# EAGLE schematic ttl (EAGLE 5.01)
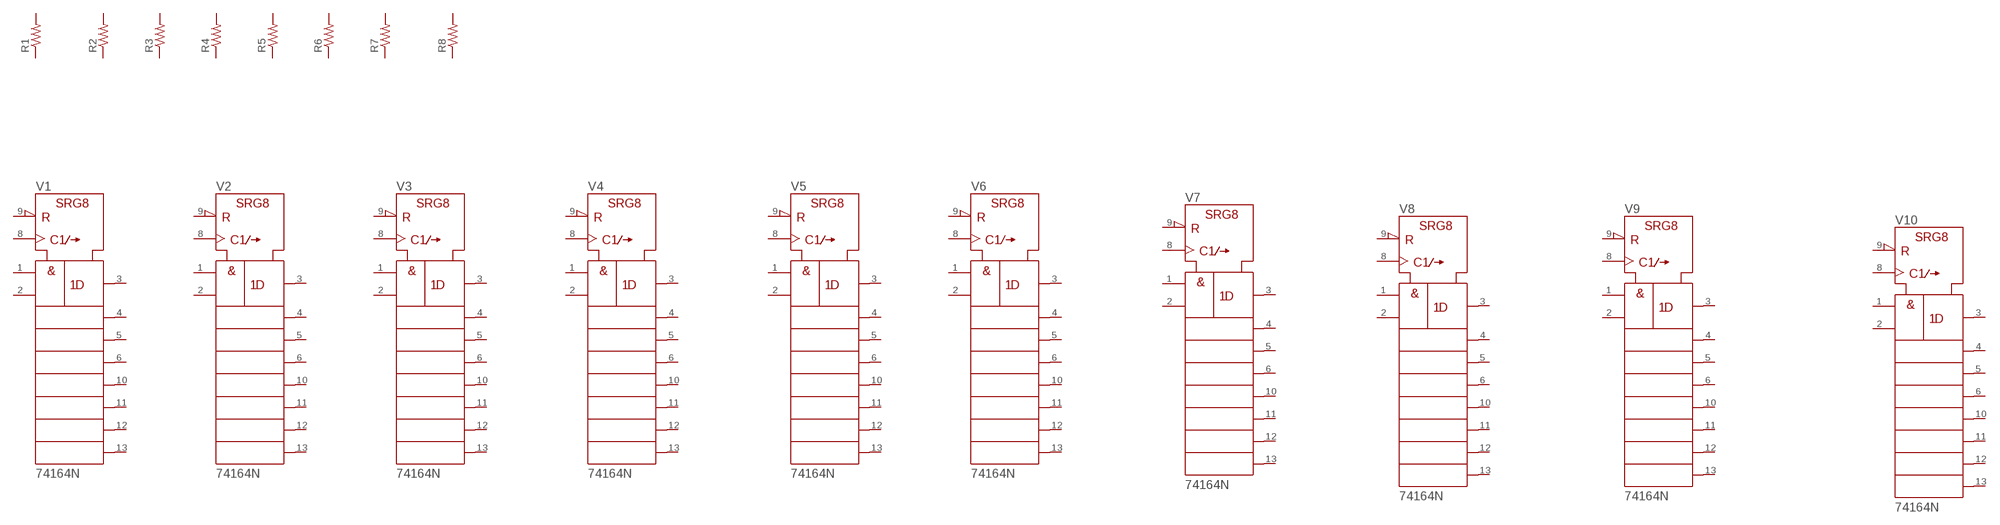
[diagram p0: schematic, sheet 1]

## Parts
R1  R-US_0204/5  [0204/5]
R2  R-US_0204/5  [0204/5]
R3  R-US_0204/5  [0204/5]
R4  R-US_0204/5  [0204/5]
R5  R-US_0204/5  [0204/5]
R6  R-US_0204/5  [0204/5]
R7  R-US_0204/5  [0204/5]
R8  R-US_0204/5  [0204/5]
V1  74164N  [DIL14]
V2  74164N  [DIL14]
V3  74164N  [DIL14]
V4  74164N  [DIL14]
V5  74164N  [DIL14]
V6  74164N  [DIL14]
V7  74164N  [DIL14]
V8  74164N  [DIL14]
V9  74164N  [DIL14]
V10  74164N  [DIL14]
Unconnected: R1.1 R1.2 R2.1 R2.2 R3.1 R3.2 R4.1 R4.2 R5.1 R5.2 R6.1 R6.2 R7.1 R7.2 R8.1 R8.2 V1.1(A) V1.2(B) V1.3(QA) V1.4(QB) V1.5(QC) V1.6(QD) V1.8(CLK) V1.9(!CLR) V1.10(QE) V1.11(QF) V1.12(QG) V1.13(QH) V2.1(A) V2.2(B) V2.3(QA) V2.4(QB) V2.5(QC) V2.6(QD) V2.8(CLK) V2.9(!CLR) V2.10(QE) V2.11(QF) V2.12(QG) V2.13(QH) V3.1(A) V3.2(B) V3.3(QA) V3.4(QB) V3.5(QC) V3.6(QD) V3.8(CLK) V3.9(!CLR) V3.10(QE) V3.11(QF) V3.12(QG) V3.13(QH) V4.1(A) V4.2(B) V4.3(QA) V4.4(QB) V4.5(QC) V4.6(QD) V4.8(CLK) V4.9(!CLR) V4.10(QE) V4.11(QF) V4.12(QG) V4.13(QH) V5.1(A) V5.2(B) V5.3(QA) V5.4(QB) V5.5(QC) V5.6(QD) V5.8(CLK) V5.9(!CLR) V5.10(QE) V5.11(QF) V5.12(QG) V5.13(QH) V6.1(A) V6.2(B) V6.3(QA) V6.4(QB) V6.5(QC) V6.6(QD) V6.8(CLK) V6.9(!CLR) V6.10(QE) V6.11(QF) V6.12(QG) V6.13(QH) V7.1(A) V7.2(B) V7.3(QA) V7.4(QB) V7.5(QC) V7.6(QD) V7.8(CLK) V7.9(!CLR) V7.10(QE) V7.11(QF) V7.12(QG) V7.13(QH) V8.1(A) V8.2(B) V8.3(QA) V8.4(QB) V8.5(QC) V8.6(QD) V8.8(CLK) V8.9(!CLR) V8.10(QE) V8.11(QF) V8.12(QG) V8.13(QH) V9.1(A) V9.2(B) V9.3(QA) V9.4(QB) V9.5(QC) V9.6(QD) V9.8(CLK) V9.9(!CLR) V9.10(QE) V9.11(QF) V9.12(QG) V9.13(QH) V10.1(A) V10.2(B) V10.3(QA) V10.4(QB) V10.5(QC) V10.6(QD) V10.8(CLK) V10.9(!CLR) V10.10(QE) V10.11(QF) V10.12(QG) V10.13(QH)

## Power pins joined to a net without a drawn wire
+UB: V1.14(+UB) V2.14(+UB) V3.14(+UB) V4.14(+UB) V5.14(+UB) V6.14(+UB) V7.14(+UB) V8.14(+UB) V9.14(+UB) V10.14(+UB)
-UB: V1.7(-UB) V2.7(-UB) V3.7(-UB) V4.7(-UB) V5.7(-UB) V6.7(-UB) V7.7(-UB) V8.7(-UB) V9.7(-UB) V10.7(-UB)

## Library data of the parts
R1-R8 = resistor:R-US_: RESISTOR, American symbol
V1-V10 = 74ttl-din:74*164: 8-bit parallel out SHIFT REGISTER